# Altium schematic sheet mccd.SchDoc
size 177 x 127 mm
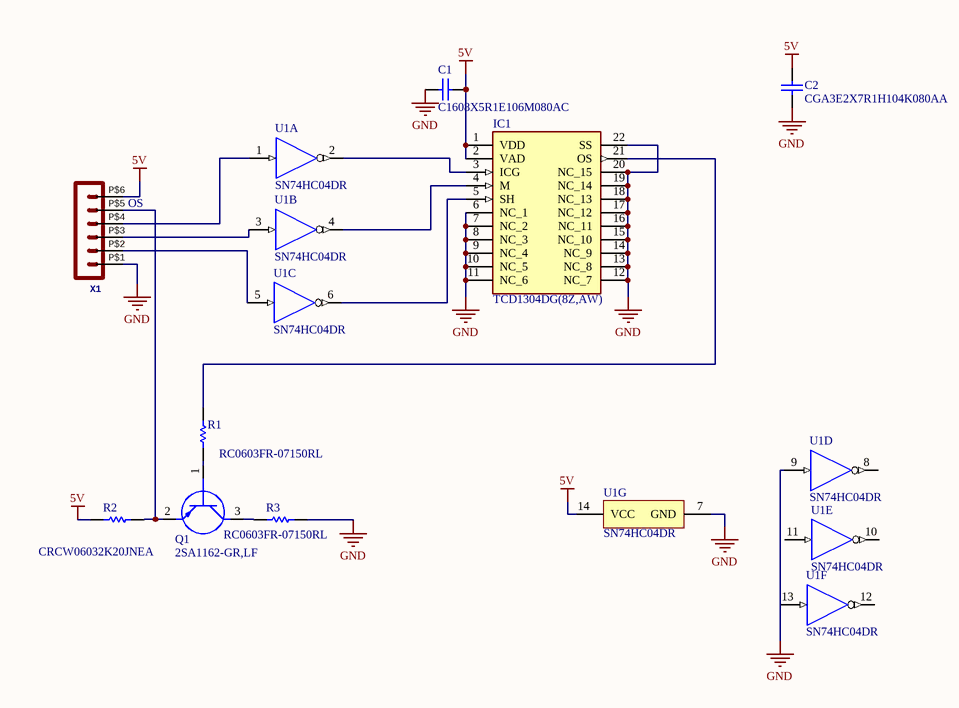
[diagram p0: mccd.SchDoc]

## Parts
C1  C1608X5R1E106M080AC  [CAPC1608X100X20VL10T10]
C2  CGA3E2X7R1H104K080AA  [CAPC1608X90X20LL10]
IC1  TCD1304DG(8Z,AW)  [DIP1016W62P254L4160H372Q22N]
Q1  2SA1162-GR,LF  [SOT95P260X140-3N]
R1  RC0603FR-07150RL  [RESC1608X55X25ML10T15]
R2  CRCW06032K20JNEA  [RESC1609X50X30ML10T20]
R3  RC0603FR-07150RL  [RESC1608X55X25ML10T15]
U1  SN74HC04DR  [D0014A_M]  (parts A,B,C,D,E,F,G of 7)
X1  Molex - Micro-Fit 3.0 Series connector,  3.00mm (0.118") pitch header, 6 positions.  [44914-0601]  (value not drawn)

## Nets
5V: C1.2 C2.2 IC1.1(VDD) IC1.2(VAD) R2.1 U1.14(VCC) X1.P$6
GND: C1.1 C2.1 IC1.6(NC_1) IC1.7(NC_2) IC1.8(NC_3) IC1.9(NC_4) IC1.10(NC_5) IC1.11(NC_6) IC1.12(NC_7) IC1.13(NC_8) IC1.14(NC_9) IC1.15(NC_10) IC1.16(NC_11) IC1.17(NC_12) IC1.18(NC_13) IC1.19(NC_14) IC1.20(NC_15) IC1.22(SS) R3.1 U1.7(GND) U1.9(4A) X1.P$1
NetIC1_3: IC1.3(ICG) U1.2(~{1Y})
NetIC1_4: IC1.4(M) U1.4(~{2Y})
NetIC1_5: IC1.5(SH) U1.6(~{3Y})
NetIC1_21: IC1.21(OS) R1.2
NetQ1_1: Q1.1(B) R1.1
NetQ1_2: Q1.2(E) R2.2 X1.P$5
NetQ1_3: Q1.3(C) R3.2
NetU1_1: U1.1(1A) X1.P$4
NetU1_3: U1.3(2A) X1.P$3
NetU1_5: U1.5(3A) X1.P$2

Not connected (* = marked no-connect by the designer): U1 8(~{4Y}) 10(~{5Y}) 11(5A) 12(~{6Y}) 13(6A)

## Notes on the sheet
- (near X1) OS

## Library data of the parts
C1 = CMP-2000-05442-1: Chip Capacitor, 10 uF, +/- 20%, 25 V, -55 to 85 degC, 0603 (1608 Metric), RoHS, Tape and Reel; Manufacturer: TDK; PCN Part Number: MLCCPartNumberChange30/Nov/2012; Other Names: 445-9015-1; Capacitance: 10µF; Design Resources: 20WNon-IsolatedBuckLEDDriverUsingPLLNK460KG; Kits: 445-9014-KIT-ND-KITMLCC100PF-22UF060310-50V; Voltage - Rated: 25V; Product Training Modules: SEAT,CCV,andTVCLDesignToolsGuidetoReplacinganElectrolyticCapacitorwithanMLCC; Online Catalog: CSeries,GeneralPurpose; Temperature Coefficient: X5R; Package Description: 2-Pin Surface Mount Device, Body 1.6 x 0.8 mm; Lead Style: -; Datasheet URL: http://download.siliconexpert.com/pdfs/2016/2/22/9/40/35/949/tdk_/manual/8010476609961980104703407078c1608x5r1e106m080ac.pdf.pdf; Category: Capacitors; Package / Case: 0603(1608Metric); Packaging: CutTape(CT); Series: C; Features: -; Family: CeramicCapacitors; Standard Package: 1; Tolerance: ±20%; Operating Temperature: -55degC~85degC; Mounting Type: SurfaceMount,MLCC; Ratings: -; Size / Dimension: 0.063"Lx0.031"W(1.60mmx0.80mm); Applications: GeneralPurpose; Package Reference: 1608; RoHS Information: RoHSCertificate-MLCC; Manufacturer URL: http://www.tdk.com/; Datasheet Version: Feb-16; Height - Seated (Max): -; Thickness (Max): 0.039"(1.00mm); Lead Spacing: -
C2 = CMP-2000-07546-1: Chip Capacitor, 0.1 uF, +/- 10%, 50 V, -55 to 125 degC, 0603 (1608 Metric), RoHS, Tape and Reel; Manufacturer: TDK; Capacitance: 100nF; Voltage: 50V; Dielectric: X7R; Package Reference: 603; Radiation Hardening: No; Composition: Ceramic; Datasheet URL: https://product.tdk.com/info/en/catalog/datasheets/mlcc_automotive_general_en.pdf; Mounting Technology: SurfaceMount; Datasheet Version: 12/2014; Width: 0.8mm; Length: 1.6mm; Tolerance: 10%; Case Code (Imperial): 0603; RoHSCompliant: True; Min Operating Temperature: -55degC; Package Description: 2-Pin Surface Mount Device, Body 1.6 x 0.8 mm; Packaging: TapeandReel; Package Quantity: 1; Voltage Rating: 50V; Mount: SurfaceMount; Lead Free: LeadFree; Depth: 0.8mm; Termination: SMD/SMT; Case Code (Metric): 1608; Thickness: 0.035inch; Height: 0.8mm; Weight: 7.1E-05oz; Voltage Rating (DC): 50V; REACH SVHC: NoSVHC; Manufacturer URL: http://www.tdk.com/; Case/Package: 0603; Max Operating Temperature: 125degC
IC1 = TCD1304DG(8Z,AW): Integrated Circuit; Manufacturer_Name: Toshiba; Datasheet Link: http://www.spectralproducts.com/pdf/TCD1304.pdf; Height: 3.72mm; Manufacturer_Part_Number: TCD1304DG(8Z,AW); Mouser Part Number: 757-TCD1304DG8ZAW; Mouser Price/Stock: https://www.mouser.com/Search/Refine.aspx?Keyword=757-TCD1304DG8ZAW
Q1 = 2SA1162-GR,LF: Transistor BJT PNP; Manufacturer_Name: Toshiba; Datasheet Link: http://toshiba.semicon-storage.com/info/docget.jsp?did=19351&prodName=2SA1162; Height: 1.4mm; Manufacturer_Part_Number: 2SA1162-GR,LF; Mouser Part Number: 757-2SA1162-GRLF; Mouser Price/Stock: https://www.mouser.com/Search/Refine.aspx?Keyword=757-2SA1162-GRLF
R1 R3 = CMP-1659-00057-1: Chip Resistor, 150 Ohm, +/- 1%, 0.1 W, -55 to 155 degC, 0603 (1608 Metric), RoHS, Tape and Reel; Viewing Angle: 20 degrees; Luminous Intensity: 200 mcd; Case\Package: Radial; Lens Style: Clear; Nominal Vf: 2.2 V; Illumination Colour: Green; PackageReference: 0603; PackageDescription: 2-Pin Surface Mount Device, Body 1.6 x 0.8 mm; Package Quantity: 1000; Packaging: Bulk; DatasheetVersion: Rev. 4, 02/2016; ComponentLink2URL: http://www.yageo.com/documents/recent/PYu-RC_Group_51_RoHS_L_04.pdf; ComponentLink1Description: Manufacturer URL; Height: 8.6 mm; ComponentLink2Description: Datasheet; Mount: Through Hole; Colour: Green; RoHSCompliant: true; ComponentLink1URL: http://www.yageo.com/; Forward Voltage: 2.2 V
R2 = CMP-2000-03169-1: Manufacturer: Vishay Dale; Part Number: CRCW06032K20JNEA
U1 = CMP-1615-00282-2: Hex Inverters, D0014A, LARGE T&R; Manufacturer: Texas Instruments; Bits(#): 6; VCC(Min)(V): 2; Technology Family: HC; Output Drive (IOL/IOH)(Max)(mA): -4/4; tpd @ Nom Voltage(Max)(ns): 20; Voltage(Nom)(V): 5; Schmitt Trigger: No; ICC @ Nom Voltage(Max)(mA): 0.02; Rating: Catalog; Input Type: CMOS; Code_JEDEC: MS-012; VCC(Max)(V): 6; PackageReference: D0014A; F @ Nom Voltage(Max)(Mhz): 20; Generic Part Number: SN74HC04; Operating Temperature Range(C): -40 to 85; Output Type: CMOS; DatasheetVersion: SCLS078F
X1 = HEADER_POS6_?44914-0601: GateName_1: G$1; SymbolName_1: HEADER_POS6; DeviceName: 44914-0601; LibraryName: con-molex-micro-fit-3_0_2; DeviceSetName: HEADER_POS6_?; Package: 44914-0601